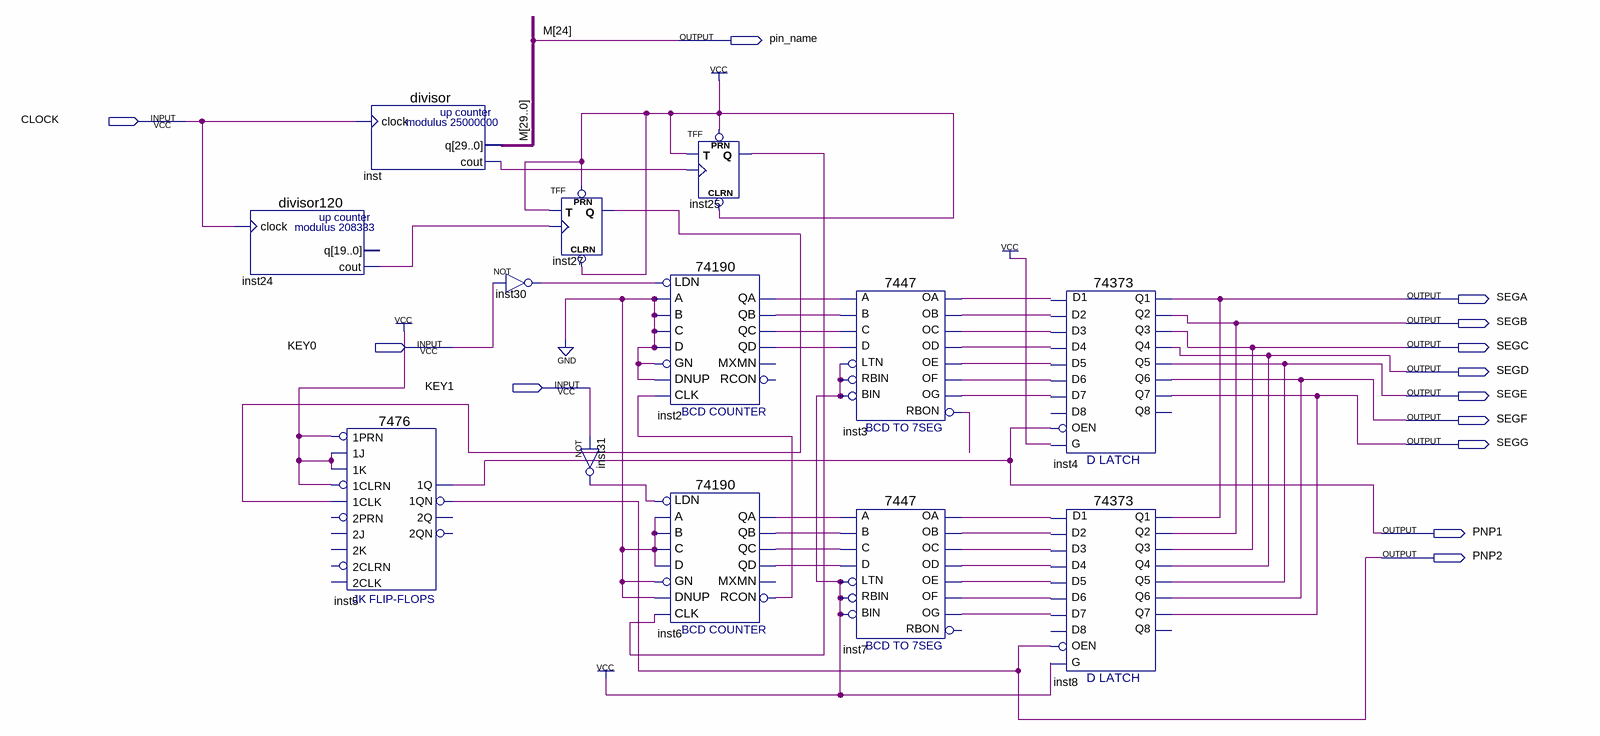
[diagram p0: schematic sheet]
// Quartus schematic circuito1.bdf as structural Verilog: 13 symbols, 13 pins
module circuito1 (
  input  CLOCK,
  input  KEY0,
  input  KEY1,
  output pin_name,
  output SEGA,
  output SEGB,
  output SEGC,
  output SEGD,
  output SEGE,
  output SEGF,
  output SEGG,
  output PNP1,
  output PNP2
);

  wire inst2_qa, inst2_qb, inst2_qc, inst2_qd, inst3_oa, inst3_ob, inst3_oc, inst3_od, inst3_oe, inst3_of,
       inst3_og, inst3_rbon, inst6_qa, inst6_qb, inst6_qc, inst6_qd, inst6_rcon, inst7_oa, inst7_ob,
       inst7_oc, inst7_od, inst7_oe, inst7_of, inst7_og, inst24_cout, inst25_q, inst27_q, inst30_out,
       inst31_out, inst_cout;
  wire [29:0] M;

  divisor120 inst24 (.clock(CLOCK), .cout(inst24_cout));  // open: q
  divisor inst (.clock(CLOCK), .q({M[29:25], pin_name, M[23:0]}), .cout(inst_cout));
  \7476  inst5 (
    .\1J (1'b1), .\1K (1'b1), .\1PRN (1'b1), .\1CLK (inst27_q), .\1CLRN (1'b1), .\1Q (PNP1), .\1QN (PNP2));  // open: 2PRN, 2J, 2K, 2CLRN, 2CLK, 2QN, 2Q
  TFF inst27 (.PRN(1'b1), .CLRN(1'b1), .T(1'b1), .CLK(inst24_cout), .Q(inst27_q));
  not inst30 (inst30_out, KEY0);
  not inst31 (inst31_out, KEY1);
  \74190  inst2 (
    .LDN(inst30_out), .A(1'b0), .C(1'b0), .B(1'b0), .D(1'b0), .GN(1'b0), .CLK(inst6_rcon), .DNUP(1'b0),
    .QA(inst2_qa), .QB(inst2_qb), .QD(inst2_qd), .QC(inst2_qc));  // open: MXMN, RCON
  \74190  inst6 (
    .LDN(inst31_out), .A(1'b0), .C(1'b0), .B(1'b0), .D(1'b0), .GN(1'b0), .CLK(inst25_q), .DNUP(1'b0),
    .QA(inst6_qa), .QB(inst6_qb), .QD(inst6_qd), .QC(inst6_qc), .RCON(inst6_rcon));  // open: MXMN
  TFF inst25 (.PRN(1'b1), .CLRN(1'b1), .T(1'b1), .CLK(inst_cout), .Q(inst25_q));
  \7447  inst3 (
    .LTN(1'b1), .B(inst2_qb), .C(inst2_qc), .D(inst2_qd), .RBIN(1'b1), .BIN(1'b1), .A(inst2_qa),
    .OB(inst3_ob), .OC(inst3_oc), .OE(inst3_oe), .OD(inst3_od), .OF(inst3_of), .OG(inst3_og), .OA(inst3_oa),
    .RBON(inst3_rbon));
  \7447  inst7 (
    .LTN(1'b1), .B(inst6_qb), .C(inst6_qc), .D(inst6_qd), .RBIN(1'b1), .BIN(1'b1), .A(inst6_qa),
    .OB(inst7_ob), .OC(inst7_oc), .OE(inst7_oe), .OD(inst7_od), .OF(inst7_of), .OG(inst7_og), .OA(inst7_oa));  // open: RBON
  \74373  inst4 (
    .D1(inst3_oa), .D3(inst3_oc), .D6(inst3_of), .D7(inst3_og), .D2(inst3_ob), .G(1'b1), .D4(inst3_od),
    .D5(inst3_oe), .OEN(PNP1), .Q3(SEGC), .Q6(SEGF), .Q7(SEGG), .Q2(SEGB), .Q4(SEGD), .Q5(SEGE), .Q1(SEGA));  // open: D8, Q8
  \74373  inst8 (
    .D1(inst7_oa), .D3(inst7_oc), .D6(inst7_of), .D7(inst7_og), .D2(inst7_ob), .G(1'b1), .D4(inst7_od),
    .D5(inst7_oe), .OEN(PNP2), .Q3(SEGC), .Q6(SEGF), .Q7(SEGG), .Q2(SEGB), .Q4(SEGD), .Q5(SEGE), .Q1(SEGA));  // open: D8, Q8

  // Other names for the same wires on the sheet: M[24] = pin_name
endmodule
